# Altium schematic sheet [4]Led_Output.SchDoc
size A
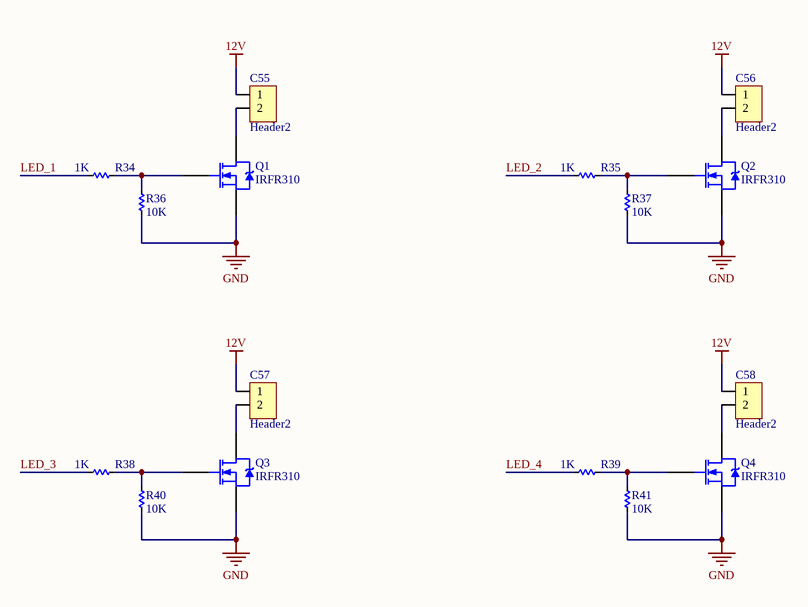
[diagram p0: [4]Led_Output.SchDoc]

## Parts
C55  Header2  [Header2]
C56  Header2  [Header2]
C57  Header2  [Header2]
C58  Header2  [Header2]
Q1  IRFR310  [TO-252AA_N]
Q2  IRFR310  [TO-252AA_N]
Q3  IRFR310  [TO-252AA_N]
Q4  IRFR310  [TO-252AA_N]
R34  1K  [RES-SMD-0603]
R35  1K  [RES-SMD-0603]
R36  10K  [RES-SMD-0603]
R37  10K  [RES-SMD-0603]
R38  1K  [RES-SMD-0603]
R39  1K  [RES-SMD-0603]
R40  10K  [RES-SMD-0603]
R41  10K  [RES-SMD-0603]

## Nets
12V: C55.1 C56.1 C57.1 C58.1
GND: Q1.3(S) Q2.3(S) Q3.3(S) Q4.3(S) R36.2 R37.2 R40.2 R41.2
LED_1: R34.2
LED_2: R35.2
LED_3: R38.2
LED_4: R39.2
NetC55_2: C55.2 Q1.4(D)
NetC56_2: C56.2 Q2.4(D)
NetC57_2: C57.2 Q3.4(D)
NetC58_2: C58.2 Q4.4(D)
NetQ1_1: Q1.1(G) R34.1 R36.1
NetQ2_1: Q2.1(G) R35.1 R37.1
NetQ3_1: Q3.1(G) R38.1 R40.1
NetQ4_1: Q4.1(G) R39.1 R41.1

## Library data of the parts
C55-C58 = Header2: Header IDC, 2 x 1 Pin Vertical 2.54mm Pitch (Non-Boxed, Male); Manufacturer: W¨¹rth Elektronik eiSos GmbH; partNo: 613002143121; ComponentLink1 Description: Manufacturer; ComponentLink2 Description: Datasheet; NoPins: 02; Created Date: 29 March 2013; ComponentLink1URL: http://www.we-online.com; ComponentLink2URL: http://katalog.we-online.de/em/datasheet/6130xx143121.pdf; Created by: Karrer Zheng
Q1-Q4 = IRFR310: HEXFET Power MOSFET; Note: Pin 2 is trimmed and is electrically connected to Drain.; Published: 8-Jun-2000; LatestRevisionDate: 20-Nov-2009; LatestRevisionNote: IPC-7351 Footprint Added.; DatasheetVersion: PD-9.597A; PackageVersion: Feb-2003; PackageReference: TO-252AA; Publisher: Altium Limited; PackageDescription: 3-Pin HEXFET Package 2.28 mm Pitch, 9.9 mm Lead Span; Code_JEDEC: TO-252-AA; ComponentLink1Description: Manufacturer Link; ComponentLink1URL: http://www.irf.com/; ComponentLink2Description: Datasheet; ComponentLink2URL: http://www.irf.com/product-info/datasheets/data/irfr310.pdf
R34-R41 = Res-SMD: Resistor; Manufacturer: Generic Components; Class: Passive; Published: 08/06/2000; Publisher: Altium Hobart Technology Centre